# EAGLE schematic ISP_programmer (EAGLE 6.5.0)
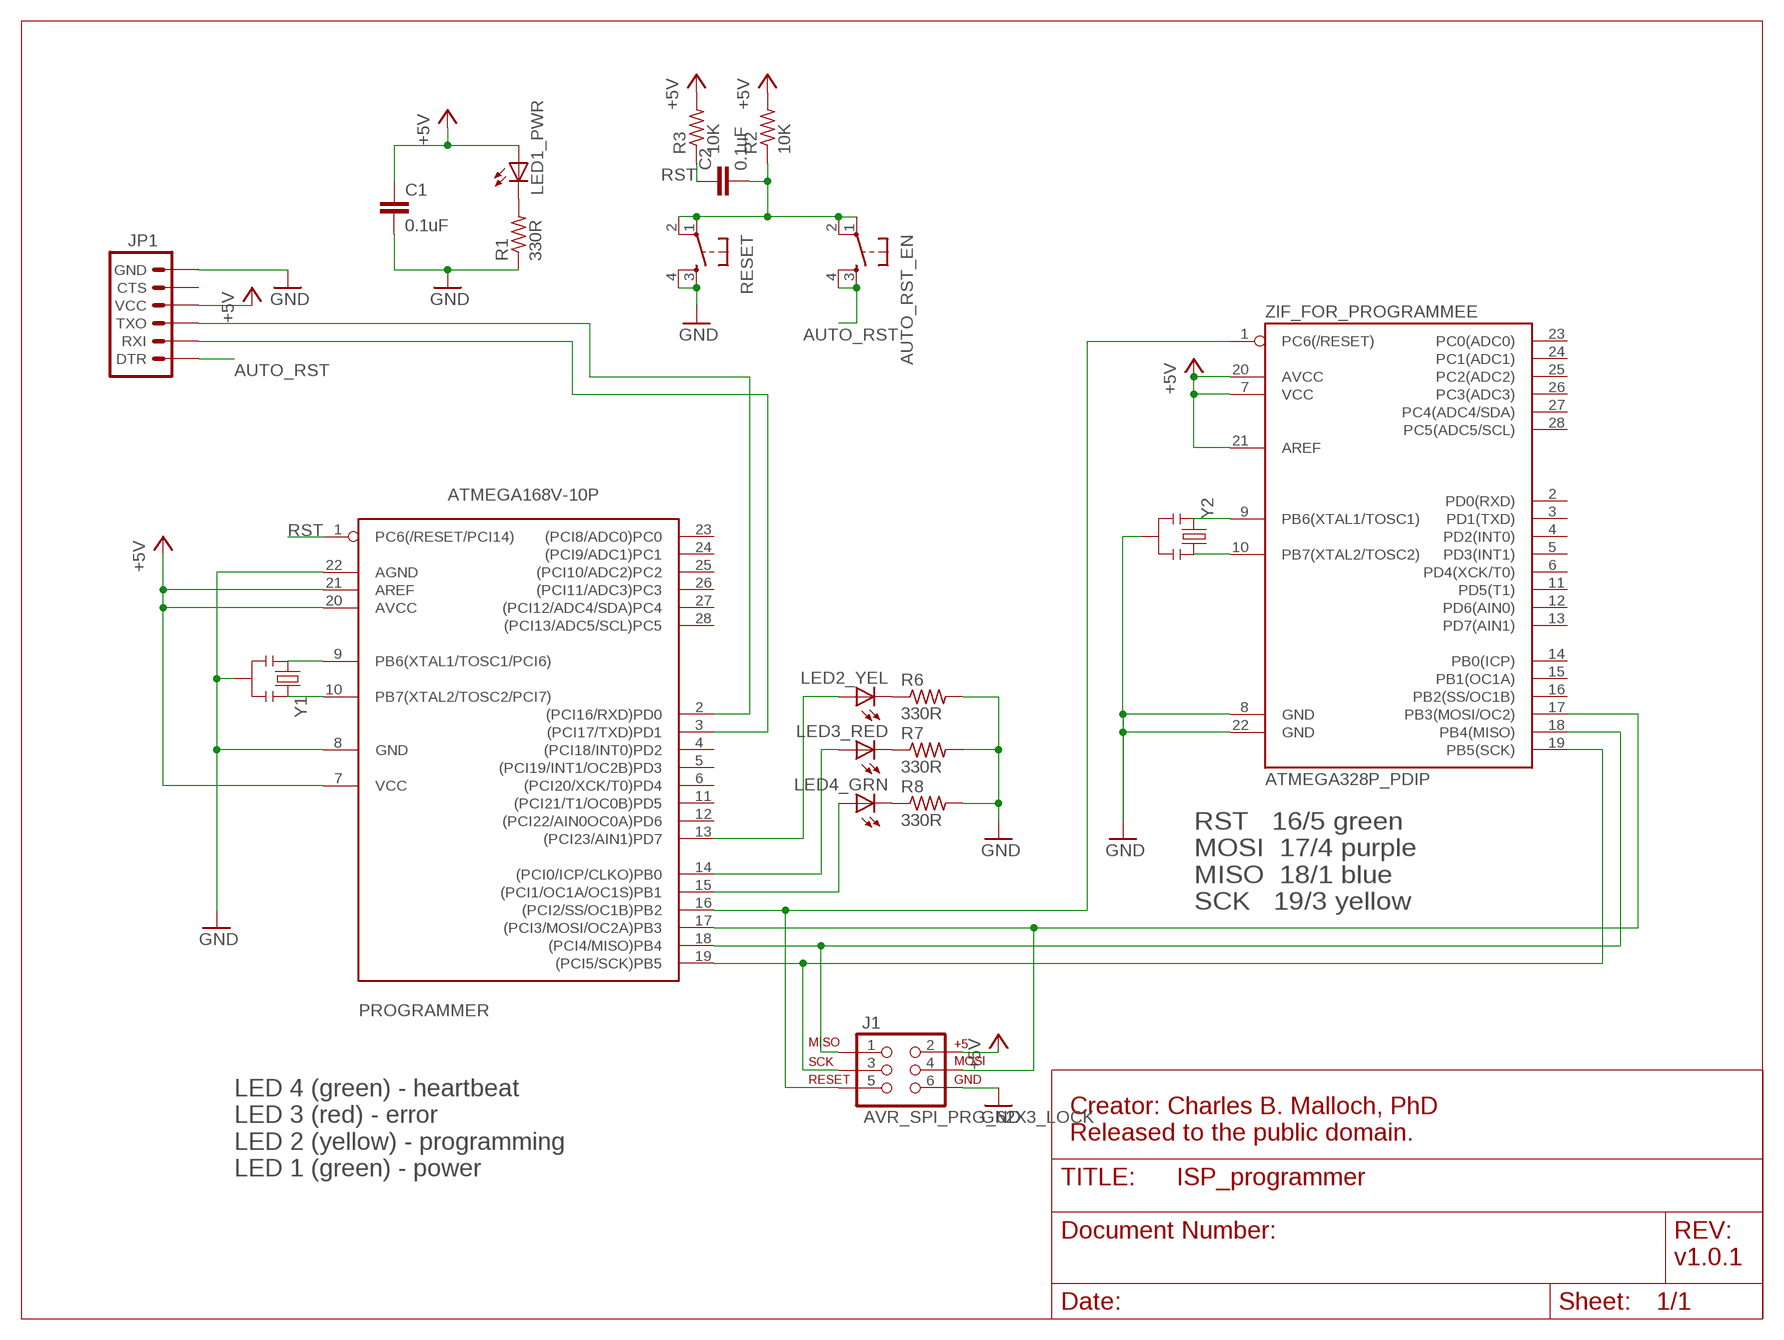
[diagram p0: schematic, sheet 1]

## Parts
AUTO_RST_EN  TAC_SWITCHPTH  [TACTILE-PTH]
C1  0.1uF  CAPEZ  [CAP-PTH-SMALLEZ]
C2  0.1uF  CAPEZ  [CAP-PTH-SMALLEZ]
J1  AVR_SPI_PRG_62X3_LOCK  [2X3_LOCK]
JP1  ARDUINO_SERIAL_PROGRAMLOCK  [1X06_LOCK]
LED1_PWR  LED3MM  [LED3MM]
LED2_YEL  LED3MM  [LED3MM]
LED3_RED  LED3MM  [LED3MM]
LED4_GRN  LED3MM  [LED3MM]
PROGRAMMER  ATMEGA168V-10P  [DIL28-3]
R1  330R  R-US_0204/7  [0204/7]
R2  10K  R-US_0204/7  [0204/7]
R3  10K  R-US_0204/7  [0204/7]
R6  330R  R-US_0204/7  [0204/7]
R7  330R  R-US_0204/7  [0204/7]
R8  330R  R-US_0204/7  [0204/7]
RESET  TAC_SWITCHPTH  [TACTILE-PTH]
Y1  RESONATORPTH  [RESONATOR-PTH]
Y2  RESONATORPTH  [RESONATOR-PTH]
ZIF_FOR_PROGRAMMEE  ATMEGA328P_PDIP  [DIL28-3]

## Nets
+5V: C1.1 J1.2 JP1.4(VCC) LED1_PWR.A PROGRAMMER.7(VCC) PROGRAMMER.20(AVCC) PROGRAMMER.21(AREF) R2.2 R3.2 ZIF_FOR_PROGRAMMEE.7(VCC) ZIF_FOR_PROGRAMMEE.20(AVCC) ZIF_FOR_PROGRAMMEE.21(AREF)
AUTO_RST: AUTO_RST_EN.3 AUTO_RST_EN.4 JP1.1(DTR)
GND: C1.2 J1.6 JP1.6(GND) PROGRAMMER.8(GND) PROGRAMMER.22(AGND) R1.1 R6.2 R7.2 R8.2 RESET.3 RESET.4 Y1.2 Y2.2 ZIF_FOR_PROGRAMMEE.8(GND) ZIF_FOR_PROGRAMMEE.22(GND)
N$1: Y2.1 ZIF_FOR_PROGRAMMEE.10(PB7(XTAL2/TOSC2))
N$2: LED1_PWR.K(C) R1.2
N$3: PROGRAMMER.9(PB6(XTAL1/TOSC1/PCI6)) Y1.1
N$4: JP1.3(TXO) PROGRAMMER.2((PCI16/RXD)PD0)
N$6: JP1.2(RXI) PROGRAMMER.3((PCI17/TXD)PD1)
N$7: AUTO_RST_EN.1 AUTO_RST_EN.2 C2.2 R2.1 RESET.1 RESET.2
N$8: Y2.3 ZIF_FOR_PROGRAMMEE.9(PB6(XTAL1/TOSC1))
N$9: LED2_YEL.K(C) R6.1
N$10: PROGRAMMER.10(PB7(XTAL2/TOSC2/PCI7)) Y1.3
N$11: J1.3 PROGRAMMER.19((PCI5/SCK)PB5) ZIF_FOR_PROGRAMMEE.19(PB5(SCK))
N$12: J1.1 PROGRAMMER.18((PCI4/MISO)PB4) ZIF_FOR_PROGRAMMEE.18(PB4(MISO))
N$13: J1.4 PROGRAMMER.17((PCI3/MOSI/OC2A)PB3) ZIF_FOR_PROGRAMMEE.17(PB3(MOSI/OC2))
N$14: J1.5 PROGRAMMER.16((PCI2/SS/OC1B)PB2) ZIF_FOR_PROGRAMMEE.1(PC6(/RESET))
N$17: LED3_RED.K(C) R7.1
N$18: LED4_GRN.K(C) R8.1
N$19: LED2_YEL.A PROGRAMMER.13((PCI23/AIN1)PD7)
N$20: LED3_RED.A PROGRAMMER.14((PCI0/ICP/CLKO)PB0)
N$21: LED4_GRN.A PROGRAMMER.15((PCI1/OC1A/OC1S)PB1)
RST: C2.1 PROGRAMMER.1(PC6(/RESET/PCI14)) R3.1
Unconnected: JP1.5(CTS) PROGRAMMER.4((PCI18/INT0)PD2) PROGRAMMER.5((PCI19/INT1/OC2B)PD3) PROGRAMMER.6((PCI20/XCK/T0)PD4) PROGRAMMER.11((PCI21/T1/OC0B)PD5) PROGRAMMER.12((PCI22/AIN0OC0A)PD6) PROGRAMMER.23((PCI8/ADC0)PC0) PROGRAMMER.24((PCI9/ADC1)PC1) PROGRAMMER.25((PCI10/ADC2)PC2) PROGRAMMER.26((PCI11/ADC3)PC3) PROGRAMMER.27((PCI12/ADC4/SDA)PC4) PROGRAMMER.28((PCI13/ADC5/SCL)PC5) ZIF_FOR_PROGRAMMEE.2(PD0(RXD)) ZIF_FOR_PROGRAMMEE.3(PD1(TXD)) ZIF_FOR_PROGRAMMEE.4(PD2(INT0)) ZIF_FOR_PROGRAMMEE.5(PD3(INT1)) ZIF_FOR_PROGRAMMEE.6(PD4(XCK/T0)) ZIF_FOR_PROGRAMMEE.11(PD5(T1)) ZIF_FOR_PROGRAMMEE.12(PD6(AIN0)) ZIF_FOR_PROGRAMMEE.13(PD7(AIN1)) ZIF_FOR_PROGRAMMEE.14(PB0(ICP)) ZIF_FOR_PROGRAMMEE.15(PB1(OC1A)) ZIF_FOR_PROGRAMMEE.16(PB2(SS/OC1B)) ZIF_FOR_PROGRAMMEE.23(PC0(ADC0)) ZIF_FOR_PROGRAMMEE.24(PC1(ADC1)) ZIF_FOR_PROGRAMMEE.25(PC2(ADC2)) ZIF_FOR_PROGRAMMEE.26(PC3(ADC3)) ZIF_FOR_PROGRAMMEE.27(PC4(ADC4/SDA)) ZIF_FOR_PROGRAMMEE.28(PC5(ADC5/SCL))

## Notes on the sheet
- RST   16/5 green
  MOSI  17/4 purple
  MISO  18/1 blue
  SCK   19/3 yellow
- Creator: Charles B. Malloch, PhD
  Released to the public domain.
- LED 4 (green) - heartbeat
  LED 3 (red) - error
  LED 2 (yellow) - programming
  LED 1 (green) - power
- v1.0.1

## Library data of the parts
AUTO_RST_EN RESET = SparkFun-Electromechanical:TAC_SWITCH: Momentary Switch Button commonly used for reset or general input. Spark Fun Electronics SKU : COM-00097 SMT- SWCH-08247
C1 C2 = SparkFun-Capacitors:CAP: Capacitor Standard 0603 ceramic capacitor, and 0.1" leaded capacitor.
J1 = SparkFun-Connectors:AVR_SPI_PRG_6: AVR ISP 6 Pin This is the reduced ISP connector for AVR programming. Common on Arduino. This footprint will take up less PCB space and can be used with a 10-pin to 6-pin adapter such as SKU: BOB-08508
JP1 = SparkFun-Connectors:ARDUINO_SERIAL_PROGRAM: FTDI connector footprints
LED1_PWR LED2_YEL LED3_RED LED4_GRN = adafruit:LED: LED OSRAM: - CHIPLED LG R971, LG N971, LY N971, LG Q971, LY Q971, LO R971, LY R971 LH N974, LH R974 LS Q976, LO Q976, LY Q976 LO Q996 - Hyper CHIPLED LW Q18S LB Q993, LB Q99A, LB R99A - SideLED LS A670, LO A670, LY A670, LG A670, LP A670 LB A673, LV A673, LT A673, LW A673 LH A674 LY A675 LS A676, LA A676, LO A676, LY A676, LW A676 LS A679, LY A679, LG A679 - Hyper Micro SIDELED® LS Y876, LA Y876, LO Y876, LY Y876 LT Y87S - SmartLED LW L88C, LW L88S LB L89C, LB L89S, LG L890 LS L89K, LO L89K, LY L89K LS L896, LA L896, LO L896, LY L896 - TOPLED LS T670, LO T670, LY T670, LG T670, LP T670 LSG T670, LSP T670, LSY T670, LOP T670, LYG T670 LG T671, LOG T671, LSG T671 LB T673, LV T673, LT T673, LW T673 LH T674 LS T676, LA T676, LO T676, LY T676, LB T676, LH T676, LSB T676, LW T676 LB T67C, LV T67C, LT T67C, LS T67K, LO T67K, LY T67K, LW E67C LS E67B, LA E67B, LO E67B, LY E67B, LB E67C, LV E67C, LT E67C LW T67C LS T679, LY T679, LG T679 LS T770, LO T770, LY T770, LG T770, LP T770 LB T773, LV T773, LT T773, LW T773 LH T774 LS E675, LA E675, LY E675, LS T675 LS T776, LA T776, LO T776, LY T776, LB T776 LHGB T686 LT T68C, LB T68C - Hyper Mini TOPLED® LB M676 - Mini TOPLED Santana® LG M470 LS M47K, LO M47K, LY M47K Source: http://www.osram.convergy.de/
PROGRAMMER = adafruit:ATMEGA168*P: MICROCONTROLLER 16 kBytes FLASH 1 kBytes SRAM 512 Bytes EEPROM USART 8-channel 10 bit ADC
R1-R3 R6-R8 = adafruit:R-US_: RESISTOR, American symbol
Y1 Y2 = SparkFun-FreqCtrl:RESONATOR: Resonator Small SMD resonator. Used, eg, on the Arduino Pro/ Pro Mini boards. 8MHz- XTAL-08895 16MHz- XTAL-08900
ZIF_FOR_PROGRAMMEE = SparkFun-DigitalIC:ATMEGA328P_PDIP: uC used in the Arduino 32kb flash, 1k EEPROM, 2k SRAM This is the through-hole version of this chip.